# Altium schematic sheet PowerSupply.SchDoc
size A4
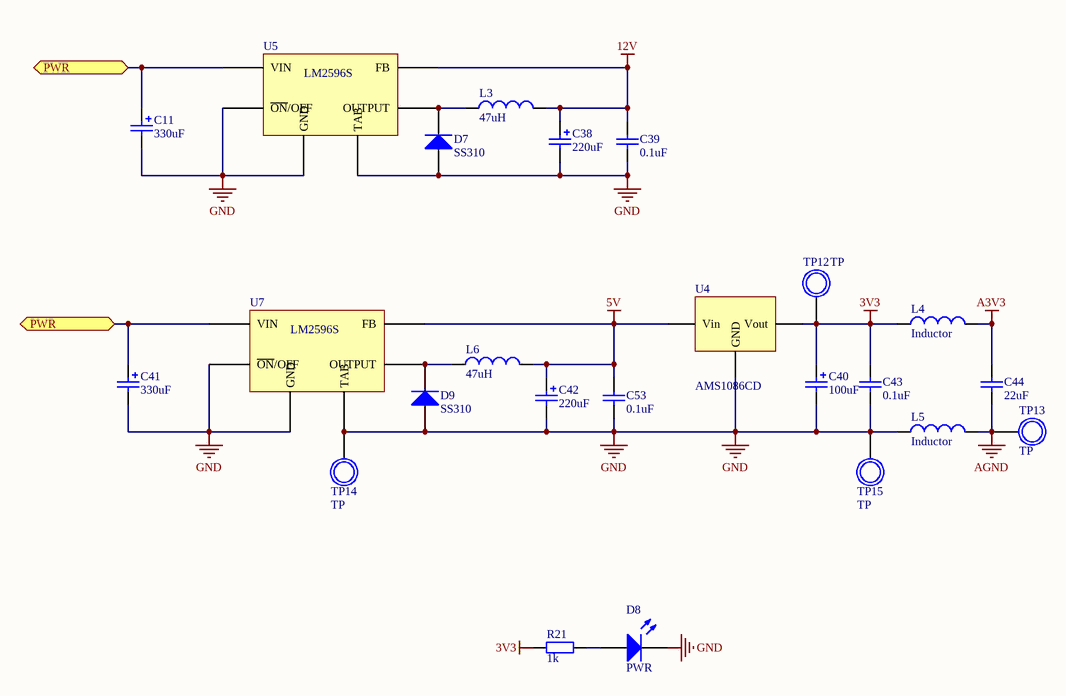
[diagram p0: PowerSupply.SchDoc]

## Parts
C11  330uF  [CAPAE109103X105N]
C38  220uF  [CAPAE109103X105N]
C39  0.1uF  [CAP1206]
C40  100uF  [CAPAE109103X105N]
C41  330uF  [CAPAE109103X105N]
C42  220uF  [CAPAE109103X105N]
C43  0.1uF  [CAP0603]
C44  22uF  [CAP1206]
C53  0.1uF  [CAP1206]
D7  SS310  [SMA]
D8  PWR  [LED0603]
D9  SS310  [SMA]
L3  47uH  [CDRH125]
L4  Inductor  [IND1206]
L5  Inductor  [IND1206]
L6  47uH  [CDRH125]
R21  1k  [RES0603]
TP12  TP  [PAD85R]
TP13  TP  [PAD85R]
TP14  TP  [PAD85R]
TP15  TP  [PAD85R]
U4  AMS1086CD  [DPAK228P1003X238-3N]
U5  LM2596S  [DPAK170P1435X465-6N]
U7  LM2596S  [DPAK170P1435X465-6N]

## Ports
PWR (bidir)

## Nets
3V3: C40.2 C43.1 L4.1 R21.1 TP12.1 U4.2(Vout)
5V: C42.2 C53.1 L6.2 U4.3(Vin) U7.4(FB)
12V: C38.2 C39.1 L3.2 U5.4(FB)
A3V3: C44.1 L4.2
AGND: C44.2 L5.2 TP13.1
GND: C11.1 C38.1 C39.2 C40.1 C41.1 C42.1 C43.2 C53.2 D7.1(A) D8.2(K) D9.1(A) L5.1 TP14.1 TP15.1 U4.1(GND) U5.3(GND) U5.5(~{ON}/OFF) U5.6(TAB) U7.3(GND) U7.5(~{ON}/OFF) U7.6(TAB)
PWR: C11.2 C41.2 U5.1(VIN) U7.1(VIN) ; port PWR
NetD7_2: D7.2(K) L3.1 U5.2(OUTPUT)
NetD8_1: D8.1(A) R21.2
NetD9_2: D9.2(K) L6.1 U7.2(OUTPUT)

## Library data of the parts
C11 C38 C40-C42 = CAP_Pol: cap pol; Tolerance: +\- 10%; Capacitance Value: 47uF; Rated Voltage: 50V
C39 C43 C53 = CAP: CAP NON-POL; Tolerance: +/-10%; Rated Voltage: 50V; Capacitance Value: 0.1uF
C44 = CAP: CAP NON-POL; Tolerance: +/-10%; Rated Voltage: 50V; Capacitance Value: 0.1uF
D7 D9 = Diode
D8 = LED
L3 L6 = Inductor
R21 = RES
TP12-TP15 = Test_Point: test point
U4 = AMS1086CD: LDO
U5 U7 = LM2596S: 1A,52KHz,Step-Down